# Altium project buso.PrjPcb
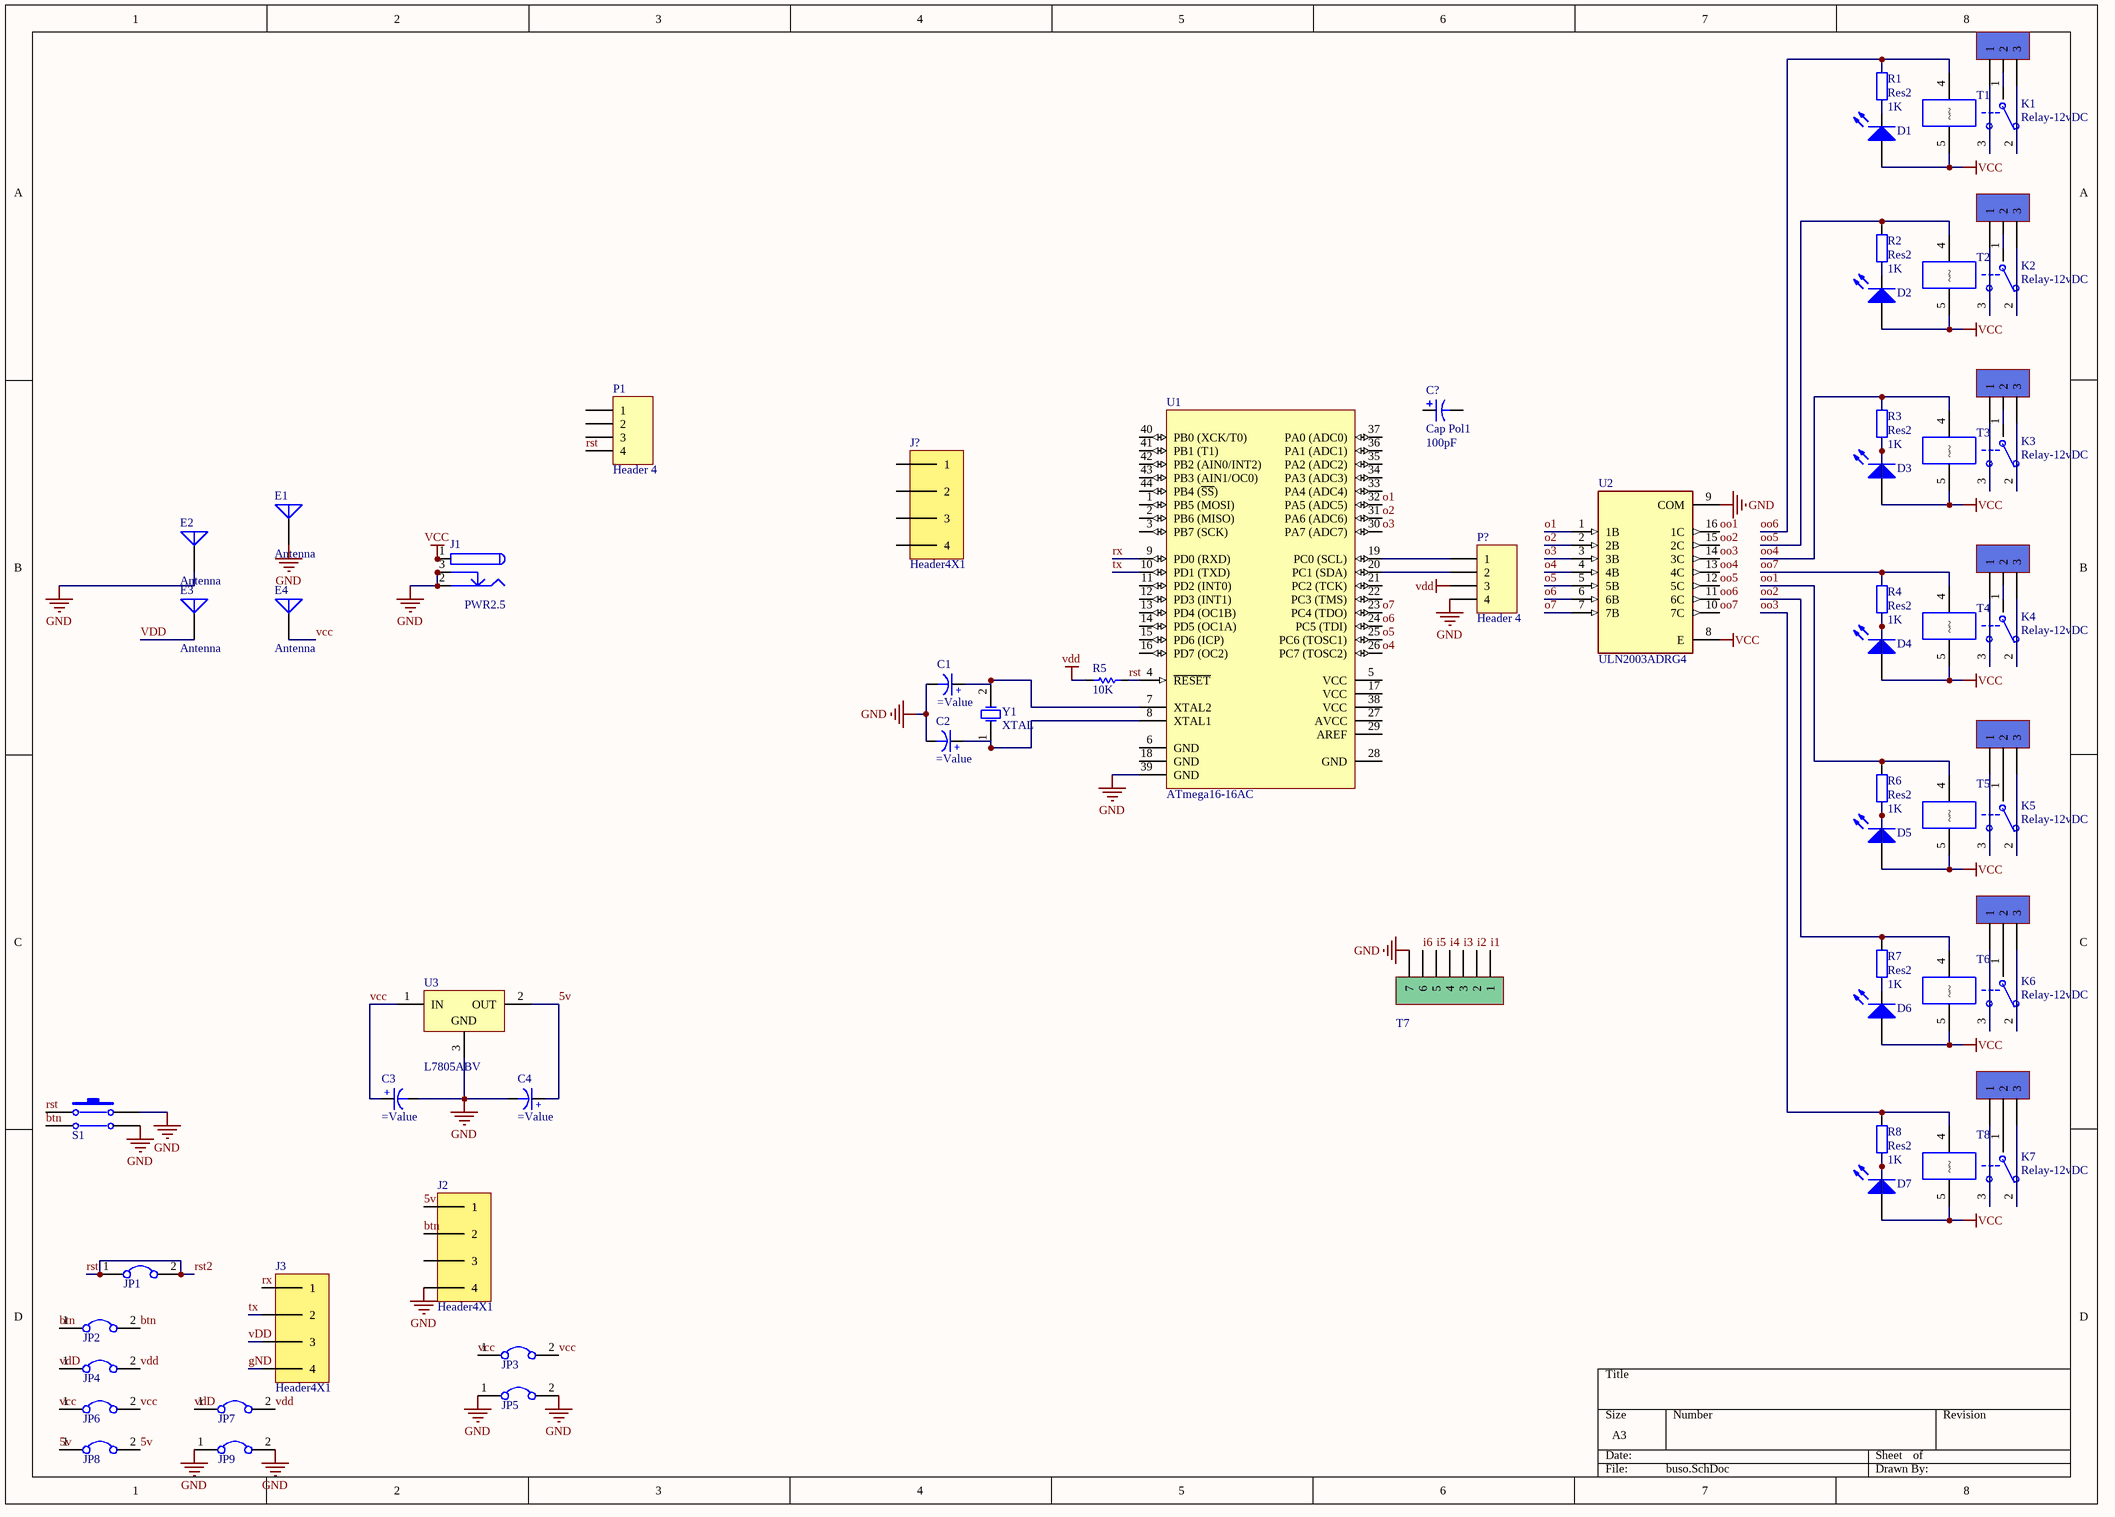
[diagram p0: buso.SchDoc]
1 sheet, 59 parts. Net scope: global (net labels, ports and power ports of the same name join across sheets).
Board file: buso.PcbDoc

## Sheet buso.SchDoc
size A3

### Parts
C1  (no value)  [ELEC-CAP-RAD10-20]
C2  (no value)  [ELEC-CAP-RAD10-20]
C3  (no value)  [ELEC-CAP-RAD10-20]
C4  (no value)  [ELEC-CAP-RAD10-20]
C?  Cap Pol1  value 100pF  [RB7.6-15]
D1  LED 3mm  [LED-3mm]  (value not drawn)
D2  LED 3mm  [LED-3mm]  (value not drawn)
D3  LED 3mm  [LED-3mm]  (value not drawn)
D4  LED 3mm  [LED-3mm]  (value not drawn)
D5  LED 3mm  [LED-3mm]  (value not drawn)
D6  LED 3mm  [LED-3mm]  (value not drawn)
D7  LED 3mm  [LED-3mm]  (value not drawn)
E1  Antenna  [PIN1]
E2  Antenna  [PIN1]
E3  Antenna  [PIN1]
E4  Antenna  [PIN1]
J1  PWR2.5  [KLD-0202]
J2  Header4X1  [HEADER 4X1]
J3  Header4X1  [HEADER 4X1]
J?  Header4X1  [HEADER 4X1]
JP1  Jumper  [Header 2X1]  (value not drawn)
JP2  Jumper  [Header 2X1]  (value not drawn)
JP3  Jumper  [Header 2X1]  (value not drawn)
JP4  Jumper  [Header 2X1]  (value not drawn)
JP5  Jumper  [Header 2X1]  (value not drawn)
JP6  Jumper  [Header 2X1]  (value not drawn)
JP7  Jumper  [Header 2X1]  (value not drawn)
JP8  Jumper  [Header 2X1]  (value not drawn)
JP9  Jumper  [Header 2X1]  (value not drawn)
K1  Relay-12vDC  [Relays]
K2  Relay-12vDC  [Relays]
K3  Relay-12vDC  [Relays]
K4  Relay-12vDC  [Relays]
K5  Relay-12vDC  [Relays]
K6  Relay-12vDC  [Relays]
K7  Relay-12vDC  [Relays]
P1  Header 4  [HDR1X4]
P?  Header 4  [HDR1X4]
R1  Res2  value 1K  [Res50]
R2  Res2  value 1K  [Res50]
R3  Res2  value 1K  [Res50]
R4  Res2  value 1K  [Res50]
R5  10K  [RES 1206 (3216X08L)]
R6  Res2  value 1K  [Res50]
R7  Res2  value 1K  [Res50]
R8  Res2  value 1K  [Res50]
S1  PUSH BUTTON DOUBLE  [PUSH BUTTON]  (value not drawn)
T1  Terminal  [phoenix terminal R 3]  (value not drawn)
T2  Terminal  [phoenix terminal R 3]  (value not drawn)
T3  Terminal  [phoenix terminal R 3]  (value not drawn)
T4  Terminal  [phoenix terminal R 3]  (value not drawn)
T5  Terminal  [phoenix terminal R 3]  (value not drawn)
T6  Terminal  [phoenix terminal R 3]  (value not drawn)
T7  Phoenix terminal  [phoenix terminal 7]  (value not drawn)
T8  Terminal  [phoenix terminal R 3]  (value not drawn)
U1  ATmega16-16AC  [44A_N]
U2  ULN2003ADRG4  [SOIC127P600X175-16N]
U3  L7805ABV  [TO220ABN]
Y1  XTAL  [R38]

### Nets
gND: C1.1(-) C2.1(-) C3.1(-) C4.1(-) E1.1(A) E2.1(A) J1.2 J1.2A J1.2B J1.3 J1.3A J1.3B J2.4 J3.4 JP5.1 JP5.2 JP9.1 JP9.2 P?.4 S1.2 S1.4 T7.7 U1.39(GND) U2.9(COM) U3.3(GND)
vcc: C3.2(+) D1.1(A) D2.1(A) D3.1(A) D4.1(A) D5.1(A) D6.1(A) D7.1(A) E4.1(A) J1.1 J1.1A J1.1B JP3.1 JP3.2 JP6.1 JP6.2 K1.5 K2.5 K3.5 K4.5 K5.5 K6.5 K7.5 U2.8(E) U3.1(IN)
VDD: E3.1(A) J3.3 JP4.1 JP4.2 JP7.1 JP7.2 P?.3 R5.1
5v: C4.2(+) J2.1 JP8.1 JP8.2 U3.2(OUT)
btn: J2.2 JP2.1 JP2.2 S1.3
i1: T7.1
i2: T7.2
i3: T7.3
i4: T7.4
i5: T7.5
i6: T7.6
o1: U1.32(PA5_(ADC5)) U2.1(1B)
o2: U1.31(PA6_(ADC6)) U2.2(2B)
o3: U1.30(PA7_(ADC7)) U2.3(3B)
o4: U1.26(PC7_(TOSC2)) U2.4(4B)
o5: U1.25(PC6_(TOSC1)) U2.5(5B)
o6: U1.24(PC5_(TDI)) U2.6(6B)
o7: U1.23(PC4_(TDO)) U2.7(7B)
oo1: K5.4 R6.2 U2.16(1C)
oo2: K6.4 R7.2 U2.15(2C)
oo3: K7.4 R8.2 U2.14(3C)
oo4: K3.4 R3.2 U2.13(4C)
oo5: K2.4 R2.2 U2.12(5C)
oo6: K1.4 R1.2 U2.11(6C)
oo7: K4.4 R4.2 U2.10(7C)
rst: JP1.1 JP1.2 P1.4 R5.2 S1.1 U1.4(~{RESET})  [also labelled rst2]
rx: J3.1 U1.9(PD0_(RXD))
tx: J3.2 U1.10(PD1_(TXD))
NetC1_2: C1.2(+) U1.7(XTAL2) Y1.2(OSC2)
NetC2_2: C2.2(+) U1.8(XTAL1) Y1.1(OSC1)
NetD1_2: D1.2(K) R1.1
NetD2_2: D2.2(K) R2.1
NetD3_2: D3.2(K) R3.1
NetD4_2: D4.2(K) R4.1
NetD5_2: D5.2(K) R6.1
NetD6_2: D6.2(K) R7.1
NetD7_2: D7.2(K) R8.1
NetK1_1: K1.1(COM) T1.2
NetK1_2: K1.2(NC) T1.3
NetK1_3: K1.3(NO) T1.1
NetK2_1: K2.1(COM) T2.2
NetK2_2: K2.2(NC) T2.3
NetK2_3: K2.3(NO) T2.1
NetK3_1: K3.1(COM) T3.2
NetK3_2: K3.2(NC) T3.3
NetK3_3: K3.3(NO) T3.1
NetK4_1: K4.1(COM) T4.2
NetK4_2: K4.2(NC) T4.3
NetK4_3: K4.3(NO) T4.1
NetK5_1: K5.1(COM) T5.2
NetK5_2: K5.2(NC) T5.3
NetK5_3: K5.3(NO) T5.1
NetK6_1: K6.1(COM) T6.2
NetK6_2: K6.2(NC) T6.3
NetK6_3: K6.3(NO) T6.1
NetK7_1: K7.1(COM) T8.2
NetK7_2: K7.2(NC) T8.3
NetK7_3: K7.3(NO) T8.1
NetP?_1: P?.1 U1.19(PC0_(SCL))
NetP?_2: P?.2 U1.20(PC1_(SDA))

Not connected (* = marked no-connect by the designer): C? 1 2; J2 3; J? 1 2 3 4; P1 1 2 3; U1 1(PB5_(MOSI)) 2(PB6_(MISO)) 3(PB7_(SCK)) 5(VCC) 6(GND) 11(PD2_(INT0)) 12(PD3_(INT1)) 13(PD4_(OC1B)) 14(PD5_(OC1A)) 15(PD6_(ICP)) 16(PD7_(OC2)) 17(VCC) 18(GND) 21(PC2_(TCK)) 22(PC3_(TMS)) 27(AVCC) 28(GND) 29(AREF) 33(PA4_(ADC4)) 34(PA3_(ADC3)) 35(PA2_(ADC2)) 36(PA1_(ADC1)) 37(PA0_(ADC0)) 38(VCC) 40(PB0_(XCK/T0)) 41(PB1_(T1)) 42(PB2_(AIN0/INT2)) 43(PB3_(AIN1/OC0)) 44(PB4_(~{SS}))

### Library data of the parts
C1-C4 = Capacitor Electrolytic: Electrolytic Capacitor
C? = Cap Pol1: Polarized Capacitor (Radial); Published: 8-Jun-2000; LatestRevisionDate: 17-Jul-2002; LatestRevisionNote: Re-released for DXP Platform.; PackageReference: RB7.6-15; Publisher: Altium Limited; PackageDescription: Polarized Capacitor (Radial); 2 Leads
D1-D7 = LED 3mm: Typical LED; Designer: Seyed Mohsen Ghasemian; Published: 02/04/2012; PackageReference: LED; Publisher: www.picpars.com; PackageDescription: LED; 2 Leads
E1-E4 = Antenna: Generic Antenna; Published: 24-Mar-1999; LatestRevisionDate: 17-Jul-2002; LatestRevisionNote: Re-released for DXP Platform.; PackageReference: PIN1; Publisher: Altium Limited
J1 = PWR2.5: Low Voltage Power Supply Connector; Published: 17-Dec-2003; DatasheetDocument: 09-May-2002; Publisher: Altium Limited; ComponentLink1Description: Manufacturer Link; ComponentLink1URL: http://domino.kycon.com/internet/Products.html
K1-K7 = Relay-05vDC: Relay-05vDC-240AC 5A; Designer: Seyed Mohsen Ghasemain; ComponentLinkURL: www.picpars.com
P1 P? = Header 4: Header, 4-Pin; LatestRevisionDate: 17-Jul-2002; LatestRevisionNote: Re-released for DXP Platform.; Publisher: Altium Limited
R1-R4 R6-R8 = Res2: Resistor; Published: 8-Jun-2000; LatestRevisionDate: 17-Jul-2002; LatestRevisionNote: Re-released for DXP Platform.; Publisher: Altium Limited; PackageDescription: Axial Device, Thru-Hole; 2 Leads; 0.4 in Pin Spacing
  R1-R4 R6 R7: PackageReference: AXIAL-0.4
  R8: PackageReference: Res50
R5 = Resistor: Tolerance: 5%; Power: 1/4 W; Value: 10K
S1 = PUSH BUTTON DOUBLE: Switch
T1-T6 T8 = Terminal 1*3: phoenix terminal R 3; Designer: Seyed Mohsen Ghasemain; E-mail: picpars@gmail.com; ComponentLinkURL: www.picpars.com
T7 = Phoenix terminal 7: Terminal 7 Pin; Designer: Seyed Mohsen Ghasemain; E-mail: picpars@gmail.com; ComponentLinkURL: www.picpars.com
U1 = ATmega16-16AC: 8-Bit AVR Microcontroller with 16K Bytes of In-System Programmable Flash Memory; Published: 17-Sep-2003; LatestRevisionDate: 16-Oct-2006; LatestRevisionNote: IPC-7351 Footprint Added.; DatasheetVersion: 2466E-AVR-10/02; PackageVersion: rev.B, Oct-2001; PackageReference: 44A; Publisher: Altium Limited; PackageDescription: 44-Pin Plastic Thin Profile Quad Flat Pack, 10 x 10 x 1.0 mm Body, 0.8 mm Pitch (TQFP); Supplier 1: Digi-Key; Supplier Part Number 1: ATMEGA16-16AC-ND; Supplier 2: Mouser; Supplier Part Number 2: 556-ATMEGA16-16AC; ComponentLink1Description: Datasheet; ComponentLink1URL: http://www.atmel.com/dyn/resources/prod_documents/doc2466.pdf; ComponentLink2Description: Atmel.com Home; ComponentLink2URL: http://www.atmel.com
U2 = ULN2003ADRG4: 50-V, 7-ch darlington transistor array, -20C to 70C 16-SOIC -40 to 70; Price: None; MP: ULN2003ADRG4; Availability: Unavailable; Package: None; Value: *
U3 = L7805ABV: Precision 1A Regulator; Note: Tab is connected to pin 3 (GND).; Published: 24-Aug-2001; LatestRevisionDate: 17-Jul-2002; LatestRevisionNote: Re-released for DXP Platform.; DatasheetVersion: Nov-1999; PackageVersion: Jun-1998; PackageReference: TO220ABN; Publisher: Altium Limited; PackageDescription: TO, Thru-Hole, Vertical, Heatsink Mounted; 3 In-Line Leads; Pitch 2.54 mm; Pin sequence 1, 3, 2; ComponentLink1Description: Manufacturer Link; ComponentLink1URL: http://www.st.com/; ComponentLink2Description: Datasheet; ComponentLink2URL: http://www.st.com/stonline/products/literature/ds/2144/l7805ab.pdf
Y1 = XTAL: Crystal Oscillator; Published: 8-Jun-2000; LatestRevisionDate: 17-Jul-2002; LatestRevisionNote: Re-released for DXP Platform.; PackageReference: R38; Publisher: Altium Limited; PackageDescription: Crystal, Thru-Hole; 2 Leads; Body 3.1 x 8.2 mm (Dia.xH)